# Altium schematic sheet Base_LPC1769.SchDoc
size Legal
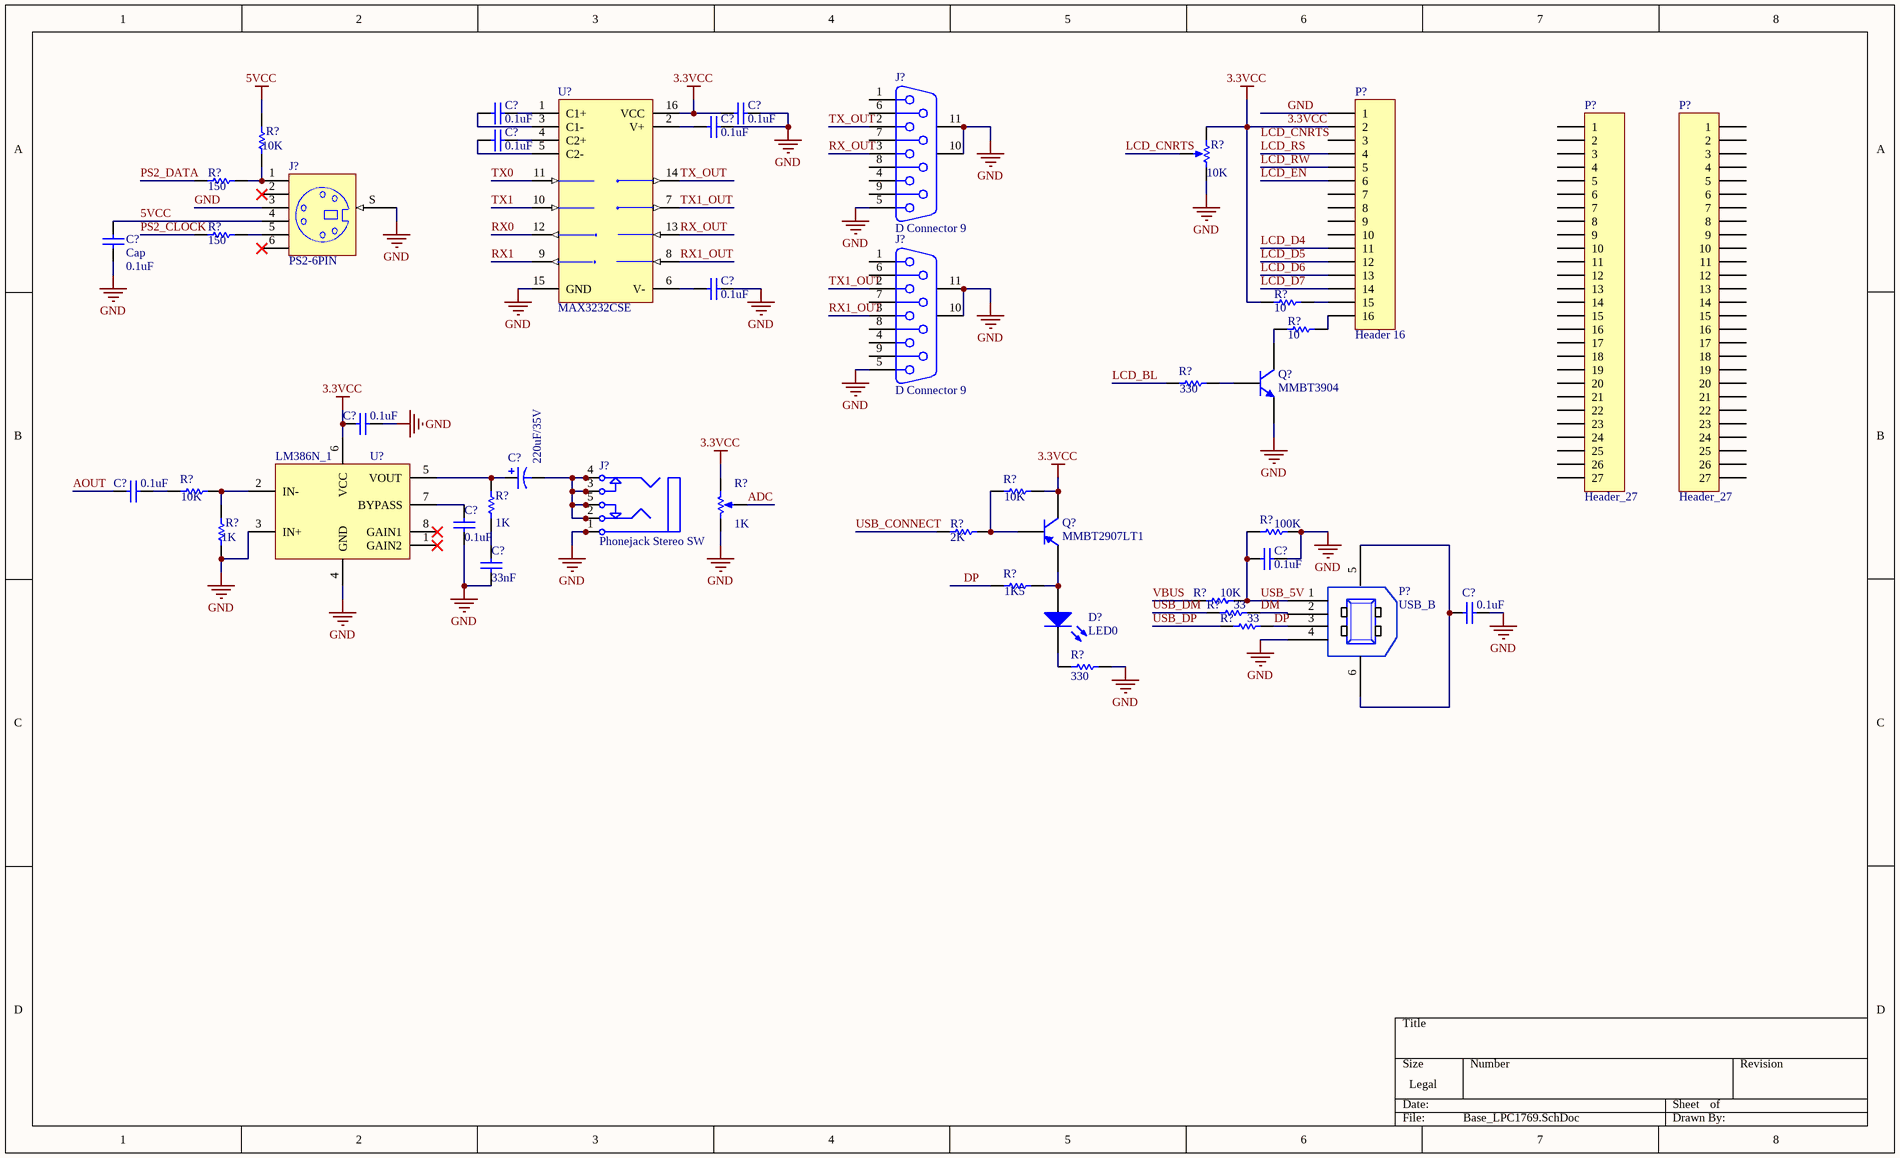
[diagram p0: Base_LPC1769.SchDoc]

## Parts
(Parts that share a designator on the sheet are numbered #1, #2 ... from top to bottom, then left to right.)
C?#1  value 0.1uF  [RAD-0.3]  (hidden comment: Cap)
C?#2  value 0.1uF  [RAD-0.3]  (hidden comment: Cap)
C?#3  value 0.1uF  [RAD-0.3]  (hidden comment: Cap)
C?#4  value 0.1uF  [RAD-0.3]  (hidden comment: Cap)
C?#5  Cap  value 0.1uF  [RAD-0.3]
C?#6  value 0.1uF  [RAD-0.3]  (hidden comment: Cap)
C?#7  value 0.1uF  [RAD-0.3]  (hidden comment: Cap)
C?#8  value 220uF/35V  [RB7.6-15]  (hidden comment: Cap Pol1)
C?#9  value 0.1uF  [RAD-0.3]  (hidden comment: Cap)
C?#10  value 0.1uF  [RAD-0.3]  (hidden comment: Cap)
C?#11  value 0.1uF  [RAD-0.3]  (hidden comment: Cap)
C?#12  value 33nF  [RAD-0.3]  (hidden comment: Cap)
C?#13  value 0.1uF  [RAD-0.3]  (hidden comment: Cap)
D?  LED0  [LED-0]
J?#1  D Connector 9  [DSUB1.385-2H9]
J?#2  PS2-6PIN  [PS2-6PIN]
J?#3  D Connector 9  [DSUB1.385-2H9]
J?#4  Phonejack Stereo SW  [ST-3150-5N]
P?#1  Header 16  [HDR1X16]
P?#2  Header_27  [Header 27 PCB]
P?#3  Header_27  [Header 27 PCB]
P?#4  USB_B  [USB_B]
Q?#1  MMBT3904  [SOT23_N]
Q?#2  MMBT2907LT1  [318-08]
R?#1  value 10K  [VR5]  (hidden comment: RPot)
R?#2  value 10K  [AXIAL-0.3]  (hidden comment: Res1)
R?#3  value 150  [AXIAL-0.3]  (hidden comment: Res1)
R?#4  value 150  [AXIAL-0.3]  (hidden comment: Res1)
R?#5  value 10  [AXIAL-0.3]  (hidden comment: Res1)
R?#6  value 10  [AXIAL-0.3]  (hidden comment: Res1)
R?#7  value 330  [AXIAL-0.3]  (hidden comment: Res1)
R?#8  value 10K  [AXIAL-0.3]  (hidden comment: Res1)
R?#9  value 10K  [AXIAL-0.3]  (hidden comment: Res1)
R?#10  value 1K  [AXIAL-0.3]  (hidden comment: Res1)
R?#11  value 1K  [VR5]  (hidden comment: RPot)
R?#12  value 1K  [AXIAL-0.3]  (hidden comment: Res1)
R?#13  value 2K  [AXIAL-0.3]  (hidden comment: Res1)
R?#14  value 100K  [AXIAL-0.3]  (hidden comment: Res1)
R?#15  value 1K5  [AXIAL-0.3]  (hidden comment: Res1)
R?#16  value 10K  [AXIAL-0.3]  (hidden comment: Res1)
R?#17  value 33  [AXIAL-0.3]  (hidden comment: Res1)
R?#18  value 33  [AXIAL-0.3]  (hidden comment: Res1)
R?#19  value 330  [AXIAL-0.3]  (hidden comment: Res1)
U?#1  MAX3232CSE  [NSO16_N]
U?#2  LM386N_1  [LM386]

## Nets
3.3VCC: C?#2.1 C?#7.1 P?#1.2 Q?#2.3(C) R?#1.1(TOP) R?#5.1 R?#9.2 R?#11.1(TOP) U?#1.16(VCC) U?#2.6(VCC)
5VCC: C?#5.1 J?#2.4 R?#2.2
GND: C?#2.2 C?#3.2 C?#5.2 C?#6.1 C?#7.2 C?#10.2 C?#11.2 C?#12.2 C?#13.2 J?#1.5 J?#1.10(MH1) J?#1.11(MH2) J?#2.3 J?#2.S J?#3.5 J?#3.10(MH1) J?#3.11(MH2) J?#4.1 J?#4.1A J?#4.1B P?#1.1 P?#4.4(GND) Q?#1.2(E) R?#1.2(BOT) R?#11.2(BOT) R?#12.2 R?#14.2 R?#19.1 U?#1.15(GND) U?#2.3(IN+) U?#2.4(GND)
ADC: R?#11.3(TAP)
AOUT: C?#9.1
DM: P?#4.2(DATA-) R?#17.2
DP: P?#4.3(DATA+) R?#15.1 R?#18.2
LCD_BL: R?#7.1
LCD_CNRTS: R?#1.3(TAP)
LCD_D4: P?#1.11
LCD_D5: P?#1.12
LCD_D6: P?#1.13
LCD_D7: P?#1.14
LCD_EN: P?#1.6
LCD_RS: P?#1.4
LCD_RW: P?#1.5
PS2_CLOCK: R?#4.1
PS2_DATA: R?#3.1
RX0: U?#1.12(R1OUT)
RX1: U?#1.9(R2OUT)
RX1_OUT: J?#3.3 U?#1.8(R2IN)
RX_OUT: J?#1.3 U?#1.13(R1IN)
TX0: U?#1.11(T1IN)
TX1: U?#1.10(T2IN)
TX1_OUT: J?#3.2 U?#1.7(T2OUT)
TX_OUT: J?#1.2 U?#1.14(T1OUT)
USB_5V: C?#11.1 P?#4.1(VCC) R?#14.1 R?#16.2
USB_CONNECT: R?#13.1
USB_DM: R?#17.1
USB_DP: R?#18.1
VBUS: R?#16.1
NetC?#1_1: C?#1.1 U?#1.3(C1-)
NetC?#1_2: C?#1.2 U?#1.1(C1+)
NetC?#3_1: C?#3.1 U?#1.2(V+)
NetC?#4_1: C?#4.1 U?#1.5(C2-)
NetC?#4_2: C?#4.2 U?#1.4(C2+)
NetC?#6_2: C?#6.2 U?#1.6(V-)
NetC?#8_1: C?#8.1 R?#10.1 U?#2.5(VOUT)
NetC?#8_2: C?#8.2 J?#4.2 J?#4.2A J?#4.2B J?#4.3 J?#4.3A J?#4.3B J?#4.4 J?#4.4A J?#4.4B J?#4.5 J?#4.5A J?#4.5B
NetC?#9_2: C?#9.2 R?#8.1
NetC?#10_1: C?#10.1 U?#2.7(BYPASS)
NetC?#12_1: C?#12.1 R?#10.2
NetC?#13_1: C?#13.1 P?#4.5(GND) P?#4.6(GND)
NetD?_1: D?.1(A) Q?#2.2(E) R?#15.2
NetD?_2: D?.2(K) R?#19.2
NetJ?#2_1: J?#2.1 R?#2.1 R?#3.2
NetJ?#2_5: J?#2.5 R?#4.2
NetP?#1_15: P?#1.15 R?#5.2
NetP?#1_16: P?#1.16 R?#6.2
NetQ?#1_1: Q?#1.1(B) R?#7.2
NetQ?#1_3: Q?#1.3(C) R?#6.1
NetQ?#2_1: Q?#2.1(B) R?#9.1 R?#13.2
NetR?#8_2: R?#8.2 R?#12.1 U?#2.2(IN-)

Not connected (* = marked no-connect by the designer): J?#1 1 4 6 7 8 9; J?#2 2* 6*; J?#3 1 4 6 7 8 9; P?#1 3 7 8 9 10; P?#2 1 2 3 4 5 6 7 8 9 10 11 12 13 14 15 16 17 18 19 20 21 22 23 24 25 26 27; P?#3 1 2 3 4 5 6 7 8 9 10 11 12 13 14 15 16 17 18 19 20 21 22 23 24 25 26 27; U?#2 1(GAIN2)* 8(GAIN1)*

## Notes on the sheet
- Labels drawn without touching a wire or pin: LCD_CNRTS

## Library data of the parts
C?#1-C?#7 C?#9-C?#13 = Cap: Capacitor; Published: 8-Jun-2000; LatestRevisionDate: 17-Jul-2002; LatestRevisionNote: Re-released for DXP Platform.; PackageReference: RAD-0.3; Publisher: Altium Limited
C?#8 = Cap Pol1: Polarized Capacitor (Radial); Published: 8-Jun-2000; LatestRevisionDate: 17-Jul-2002; LatestRevisionNote: Re-released for DXP Platform.; PackageReference: RB7.6-15; Publisher: Altium Limited
D? = LED0: Typical INFRARED GaAs LED; Published: 8-Jun-2000; LatestRevisionDate: 08-Jul-2005; LatestRevisionNote: Mech Layer 1 removed.; PackageReference: LED-0; Publisher: Altium Limited
J?#1 J?#3 = D Connector 9: Receptacle Assembly, 9 Position, Right Angle; PackageDocument: O; Positions: 9; Published: 15-Jun-2001; LatestRevisionDate: 17-Jul-2002; LatestRevisionNote: Re-released for DXP Platform.; DatasheetDocument: 1-Sep-1999; PackageReference: 788750; Publisher: Altium Limited; Orientation: Right Angle; Gender: Receptacle
J?#2 = PS2-6PIN: 6 Pin Through Hole PS2 Socket (Kycon P/N); Published: 17-Dec-2003; Publisher: Altium Limited; ComponentLink1Description: Manufacturer Link; ComponentLink1URL: http://www.oupiin.com/prodindx.html#Headers
J?#4 = Phonejack Stereo SW: 3-Conductor Jack with 2 break contacts (normals) and 2 auxiliary make contacts; Published: 5-Jan-2004; LatestRevisionDate: 17-Dec-2003; LatestRevisionNote: PCB Footprint replaced.; DatasheetDocument: 07-Mar-2000; Publisher: Altium Limited; ComponentLink1Description: Manufacturer Link; ComponentLink1URL: http://domino.kycon.com/internet/Products.html
P?#1 = Header 16: Header, 16-Pin; LatestRevisionDate: 17-Jul-2002; LatestRevisionNote: Re-released for DXP Platform.; Publisher: Altium Limited
P?#2 P?#3 = Header_27: Header 27: None
P?#4 = USB_B: CONECTOR USB TIPO B ANG RECTO DIP; Manufacturer: AG ELECTRONICA; Num Part: USBB/F90_DIP; Value: none
Q?#1 = MMBT3904: NPN Switching Transistor; Published: 17-Sep-2003; LatestRevisionDate: 12-Dec-2006; LatestRevisionNote: IPC-7351 Footprint Added.; DatasheetVersion: 13-May-2002; PackageVersion: May-1999; PackageReference: SOT23; Publisher: Altium Limited; PackageDescription: 3-Pin SOT-23 Package 0.95 mm Pitch, 2.3 mm Lead Span; ComponentLink1Description: Manufacturer Link; ComponentLink1URL: http://www.semiconductors.philips.com/; ComponentLink2Description: Datasheet; ComponentLink2URL: http://www.semiconductors.philips.com/acrobat/datasheets/MMBT3904_4.pdf
Q?#2 = MMBT2907LT1: General Purpose Transistor PNP Silicon; Published: 29-Sep-2000; LatestRevisionDate: 17-Jul-2002; LatestRevisionNote: Re-released for DXP Platform.; DatasheetVersion: 1996; PackageVersion: 1997; PackageReference: 318-08; Publisher: Altium Limited; PackageDescription: SOT-23; 3 Leads; Body 3.0 x 2.6 mm, inc. leads (LxW max); ComponentLink1Description: Manufacturer Link; ComponentLink1URL: http://www.onsemi.com/site/products/landing?taxonomyID=194
R?#1 R?#11 = RPot: Potentiometer; Sim Note: Enter the Resistance value and the set point into parameter fields.; Set Position: 0.5; Published: 8-Jun-2000; LatestRevisionDate: 17-Jul-2002; LatestRevisionNote: Re-released for DXP Platform.; PackageReference: VR5; Publisher: Altium Limited
R?#2-R?#10 R?#12-R?#19 = Res1: Resistor; Published: 8-Jun-2000; LatestRevisionDate: 17-Jul-2002; LatestRevisionNote: Re-released for DXP Platform.; PackageReference: AXIAL-0.3; Publisher: Altium Limited
U?#1 = MAX3232CSE: 3.0V TO 5.5V, Low-Power, up to 1Mbps, True RS-232 Transceiver Using Four 0.1µF External Capacitor; Published: 16-Jan-2001; LatestRevisionDate: 13-Apr-2006; LatestRevisionNote: IPC-7351 Footprint Added.; DatasheetVersion: Mar-1999; PackageReference: NSO16; Publisher: Altium Limited; PackageDescription: 16-Pin Small Outline Integrated Circuit 1.27 mm Pitch; Code_JEDEC: MS-012-AC; Code_IPC: SOIC127P600-16; ComponentLink1Description: Manufacturer Link; ComponentLink1URL: http://www.maxim-ic.com/; ComponentLink2Description: Datasheet; ComponentLink2URL: http://pdfserv.maxim-ic.com/en/ds/MAX3222-MAX3241.pdf
U?#2 = LM386N_1: Value: None